# EAGLE design HB-UNI-SenAct-4-4-RC_V2.0 (EAGLE 9.3.1)
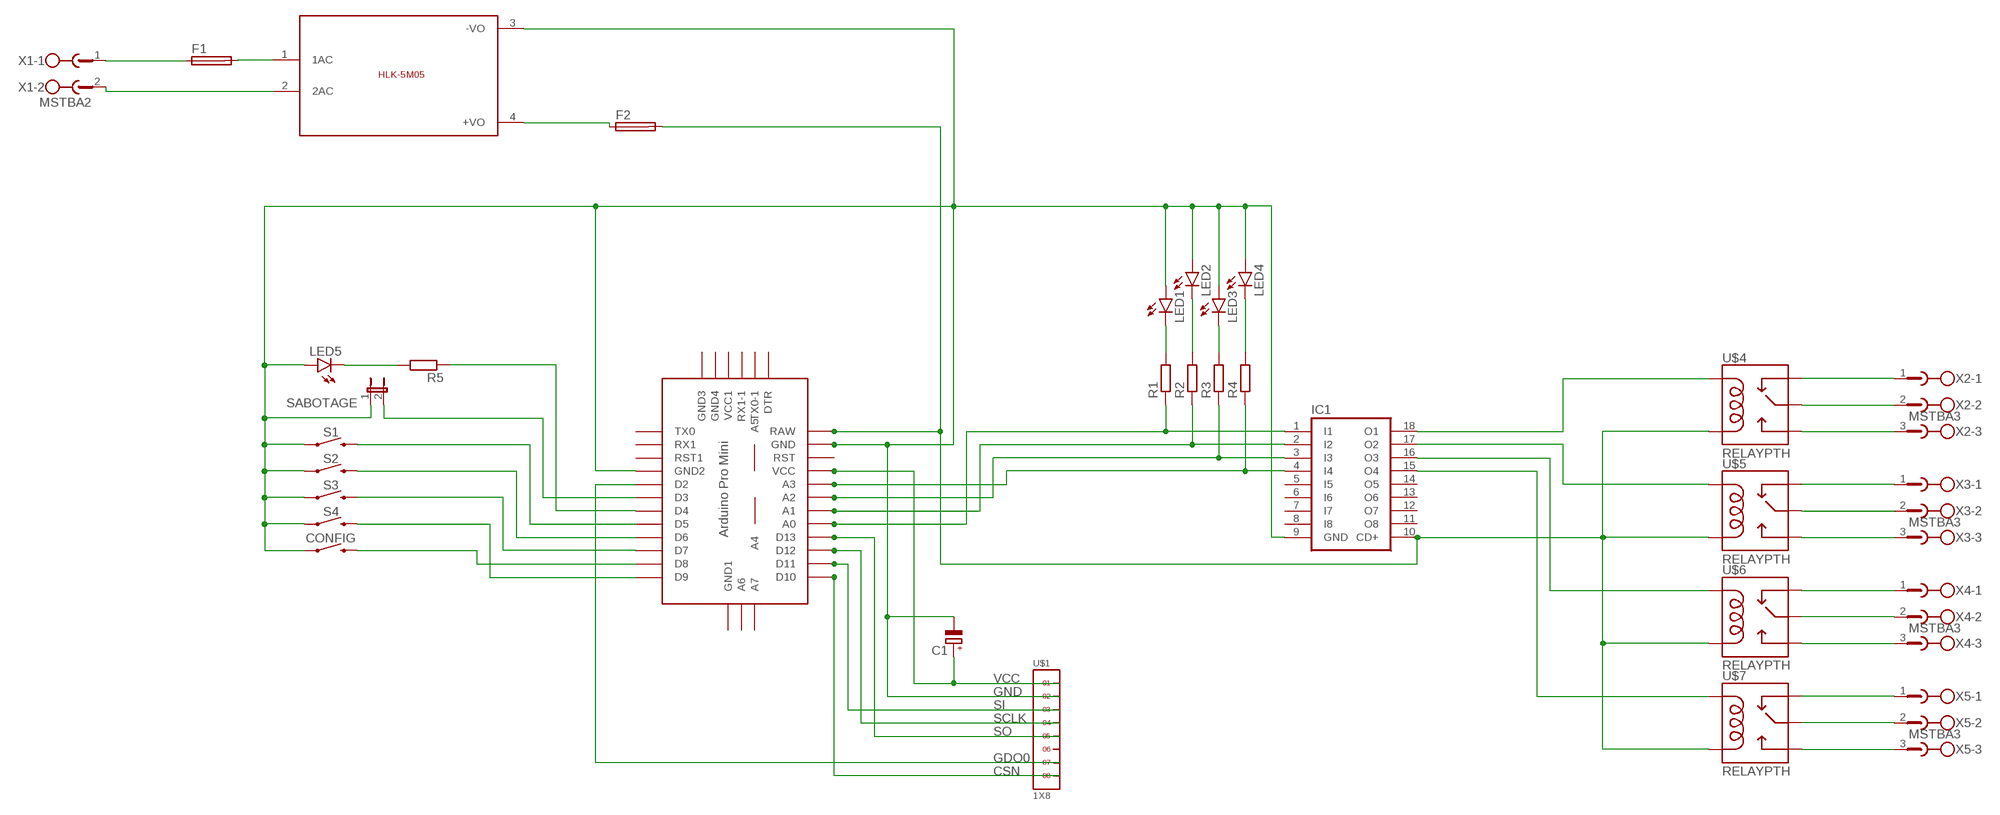
[diagram p0: schematic, sheet 1]

## Parts
C1  CPOL-EUE2.5-5  [E2,5-5]
CONFIG  MOMENTARY-SWITCH-SPST-PTH-6.0MM-KIT  [TACTILE_SWITCH_PTH_6.0MM_KIT]
F1  SH22,5A  [SH22,5A]
F2  SH22,5A  [SH22,5A]
IC1  ULN2803A  [DIL18]
LED1  LED3MM  [LED3MM]
LED2  LED3MM  [LED3MM]
LED3  LED3MM  [LED3MM]
LED4  LED3MM  [LED3MM]
LED5  LED3MM  [LED3MM]
R1  R-EU_0309/10  [0309/10]
R2  R-EU_0309/10  [0309/10]
R3  R-EU_0309/10  [0309/10]
R4  R-EU_0309/10  [0309/10]
R5  R-EU_0309/10  [0309/10]
S1  MOMENTARY-SWITCH-SPST-PTH-6.0MM-KIT  [TACTILE_SWITCH_PTH_6.0MM_KIT]
S2  MOMENTARY-SWITCH-SPST-PTH-6.0MM-KIT  [TACTILE_SWITCH_PTH_6.0MM_KIT]
S3  MOMENTARY-SWITCH-SPST-PTH-6.0MM-KIT  [TACTILE_SWITCH_PTH_6.0MM_KIT]
S4  MOMENTARY-SWITCH-SPST-PTH-6.0MM-KIT  [TACTILE_SWITCH_PTH_6.0MM_KIT]
SABOTAGE  JP1E  [JP1]
U$1  1X8  [1X8]
U$2  ABK-PRO-MINI  [ABK-PRO-MINI]
U$3  5VDC/5W  HLK-5M05  [HLK-5M05]
U$4  RELAYPTH  [SRD-05VDC-SL-C]
U$5  RELAYPTH  [SRD-05VDC-SL-C]
U$6  RELAYPTH  [SRD-05VDC-SL-C]
U$7  RELAYPTH  [SRD-05VDC-SL-C]
X1  MSTBA2  [MSTBA2]
X2  MSTBA3  [MSTBA3]
X3  MSTBA3  [MSTBA3]
X4  MSTBA3  [MSTBA3]
X5  MSTBA3  [MSTBA3]

## Nets
CSN: U$1.8 U$2.D10
GDO0: U$1.7 U$2.D2
GND: C1.- CONFIG.1 IC1.9(GND) LED1.A LED2.A LED3.A LED4.A LED5.A S1.1 S2.1 S3.1 S4.1 SABOTAGE.1 U$1.2 U$2.GND U$2.GND1(GND2) U$3.3(-VO)
N$1: IC1.1(I1) R1.1 U$2.A0
N$2: IC1.2(I2) R2.1 U$2.A1
N$3: IC1.3(I3) R3.1 U$2.A2
N$4: IC1.4(I4) R4.1 U$2.A3
N$5: LED1.K(C) R1.2
N$6: LED2.K(C) R2.2
N$7: LED3.K(C) R3.2
N$8: LED4.K(C) R4.2
N$9: F1.1 X1.1
N$10: F2.1 U$3.4(+VO)
N$11: U$3.2(2AC) X1.2
N$12: S1.3 U$2.D5
N$13: S2.3 U$2.D6
N$14: S3.3 U$2.D7
N$15: S4.3 U$2.D9
N$16: CONFIG.3 U$2.D8
N$17: R5.1 U$2.D4
N$18: LED5.K(C) R5.2
N$19: F1.2 U$3.1(1AC)
N$20: SABOTAGE.2 U$2.D3
N$21: U$6.SWCLOSED(SWCLOSE) X4.1
N$22: U$7.SWCOMMON X5.2
N$23: U$6.SWOPEN X4.3
N$24: F2.2 IC1.10(CD+) U$2.RAW U$4.COIL0 U$5.COIL0 U$6.COIL0 U$7.COIL0
N$25: U$7.SWCLOSED(SWCLOSE) X5.1
N$26: U$6.SWCOMMON X4.2
N$27: U$7.SWOPEN X5.3
N$28: U$5.SWOPEN X3.3
N$29: U$5.SWCOMMON X3.2
N$30: U$5.SWCLOSED(SWCLOSE) X3.1
N$31: U$4.SWOPEN X2.3
N$32: U$4.SWCOMMON X2.2
N$33: U$4.SWCLOSED(SWCLOSE) X2.1
N$34: IC1.18(O1) U$4.COIL1
N$35: IC1.17(O2) U$5.COIL1
N$36: IC1.16(O3) U$6.COIL1
N$37: IC1.15(O4) U$7.COIL1
SCLK: U$1.4 U$2.D12
SI: U$1.3 U$2.D11
SO: U$1.5 U$2.D13
VCC: C1.+ U$1.1 U$2.VCC
Unconnected: IC1.5(I5) IC1.6(I6) IC1.7(I7) IC1.8(I8) IC1.11(O8) IC1.12(O7) IC1.13(O6) IC1.14(O5) U$1.6 U$2.A4 U$2.A5 U$2.A6 U$2.A7 U$2.DTR U$2.GND2(GND3) U$2.GND3(GND4) U$2.GND4(GND1) U$2.RST U$2.RST1 U$2.RX1 U$2.RX1-1 U$2.TX0 U$2.TX0-1 U$2.VCC1

## Library data of the parts
C1 = resistor:CPOL-EU: POLARIZED CAPACITOR, European symbol
CONFIG S1-S4 = SparkFun-Switches:MOMENTARY-SWITCH-SPST: Momentary Switch (Pushbutton) - SPST Normally-open (NO) SPST momentary switches (buttons, pushbuttons). Variants PTH-12MM - 12mm square, through-hole Momentary Pushbutton Switch - 12mm Square <https://www.sparkfun.com/products/9190> (COM-09190) PTH-6.0MM, PTH-6.0MM-KIT - 6.0mm square, through-hole Mini Pushbutton Switch <https://www.sparkfun.com/products/97> (COM-00097) KIT package intended for soldering kit's - only one side of pads' copper is exposed. PTH-RIGHT-ANGLE-KIT - Right-angle, through-hole Right Angle Tactile Button <https://www.sparkfun.com/products/10791> - Used on SparkFun BigTime Watch Kit <https://www.sparkfun.com/products/11734> SMD-12MM - 12mm square, surface-mount Tactile Button - SMD (12mm) <https://www.sparkfun.com/products/12993> (COM-12993) Used on SparkFun PicoBoard <https://www.sparkfun.com/products/11888> SMD-4.5MM - 4.5mm Square Trackball Switch Used on SparkFun Blackberry Trackballer Breakout <https://www.sparkfun.com/products/13169> SMD-4.6MMX2.8MM - 4.60mm x 2.80mm, surface mount Used on SparkFun SAMD21 Mini Breakout <https://www.sparkfun.com/products/13664> SMD-5.2MM, SMD-5.2-REDUNDANT - 5.2mm square, surface-mount Mini Pushbutton Switch - SMD <https://www.sparkfun.com/products/8720> (COM-08720) Used on Arduino Pro Mini <https://www.sparkfun.com/products/11114> REDUNDANT package connects both switch circuits together SMD-6.0X3.5MM - 6.0 x 3.5mm, surface mount Momentary Reset Switch SMD <https://www.sparkfun.com/products/8229> (COM-08229) SMD-6.2MM-TALL - 6.2mm square, surface mount Tactile Button - SMD (6mm) <https://www.sparkfun.com/products/12992> Used on SparkFun Digital Sandbox <https://www.sparkfun.com/products/12651> SMD-RIGHT-ANGLE - Right-angle, surface mount Used on SparkFun Block for Intel® Edison - Arduino <https://www.sparkfun.com/products/13036>; PROD_ID: SWCH-08441; SF_SKU: COM-00097
F1 F2 = fuse:SH22,5A: FUSE HOLDER grid 22,5mm, isolated cap OGN0031 8201, Schurter (Buerklin); MPN: 0031.7701.11; OC_FARNELL: unknown; OC_NEWARK: 04F1224
IC1 = uln-udn:ULN2803A: DRIVER ARRAY
LED1-LED5 = led:LED: LED OSRAM: - CHIPLED LG R971, LG N971, LY N971, LG Q971, LY Q971, LO R971, LY R971 LH N974, LH R974 LS Q976, LO Q976, LY Q976 LO Q996 - Hyper CHIPLED LW Q18S LB Q993, LB Q99A, LB R99A - SideLED LS A670, LO A670, LY A670, LG A670, LP A670 LB A673, LV A673, LT A673, LW A673 LH A674 LY A675 LS A676, LA A676, LO A676, LY A676, LW A676 LS A679, LY A679, LG A679 - Hyper Micro SIDELED® LS Y876, LA Y876, LO Y876, LY Y876 LT Y87S - SmartLED LW L88C, LW L88S LB L89C, LB L89S, LG L890 LS L89K, LO L89K, LY L89K LS L896, LA L896, LO L896, LY L896 - TOPLED LS T670, LO T670, LY T670, LG T670, LP T670 LSG T670, LSP T670, LSY T670, LOP T670, LYG T670 LG T671, LOG T671, LSG T671 LB T673, LV T673, LT T673, LW T673 LH T674 LS T676, LA T676, LO T676, LY T676, LB T676, LH T676, LSB T676, LW T676 LB T67C, LV T67C, LT T67C, LS T67K, LO T67K, LY T67K, LW E67C LS E67B, LA E67B, LO E67B, LY E67B, LB E67C, LV E67C, LT E67C LW T67C LS T679, LY T679, LG T679 LS T770, LO T770, LY T770, LG T770, LP T770 LB T773, LV T773, LT T773, LW T773 LH T774 LS E675, LA E675, LY E675, LS T675 LS T776, LA T776, LO T776, LY T776, LB T776 LHGB T686 LT T68C, LB T68C - Hyper Mini TOPLED® LB M676 - Mini TOPLED Santana® LG M470 LS M47K, LO M47K, LY M47K Source: http://www.osram.convergy.de LUXEON: - LUMILED® LXK2-PW12-R00, LXK2-PW12-S00, LXK2-PW14-U00, LXK2-PW14-V00 LXK2-PM12-R00, LXK2-PM12-S00, LXK2-PM14-U00 LXK2-PE12-Q00, LXK2-PE12-R00, LXK2-PE12-S00, LXK2-PE14-T00, LXK2-PE14-U00 LXK2-PB12-K00, LXK2-PB12-L00, LXK2-PB12-M00, LXK2-PB14-N00, LXK2-PB14-P00, LXK2-PB14-Q00 LXK2-PR12-L00, LXK2-PR12-M00, LXK2-PR14-Q00, LXK2-PR14-R00 LXK2-PD12-Q00, LXK2-PD12-R00, LXK2-PD12-S00 LXK2-PH12-R00, LXK2-PH12-S00 LXK2-PL12-P00, LXK2-PL12-Q00, LXK2-PL12-R00 Source: www.luxeon.com KINGBRIGHT: KA-3528ASYC Source: www.kingbright.com
R1-R5 = resistor:R-EU_: RESISTOR, European symbol
SABOTAGE = jumper:JP1E: JUMPER
U$1 = headers(2mm):1X8
U$2 = Arduino-clone:ABK-PRO-MINI: ABK Pro-Mini Arduino Clone
U$3 = HLK-5M05:HLK-5M05: HLK-5M05 is an 5Volt/5W smps developed by HI-LINK; SIZE: 23x38(mm)
U$4-U$7 = SRD-05VDC-SL-C:RELAY: SPDT relay (COM-00101)
X1 = con-phoenix-508:MSTBA2: PHOENIX; MF: FARNELL; MPN: 1757242; OC_FARNELL: 3705171; OC_NEWARK: 71C4161
X2-X5 = con-phoenix-508:MSTBA3: PHOENIX; MF: FARNELL; MPN: 1757255; OC_FARNELL: 3705183; OC_NEWARK: 71C4162

## Board
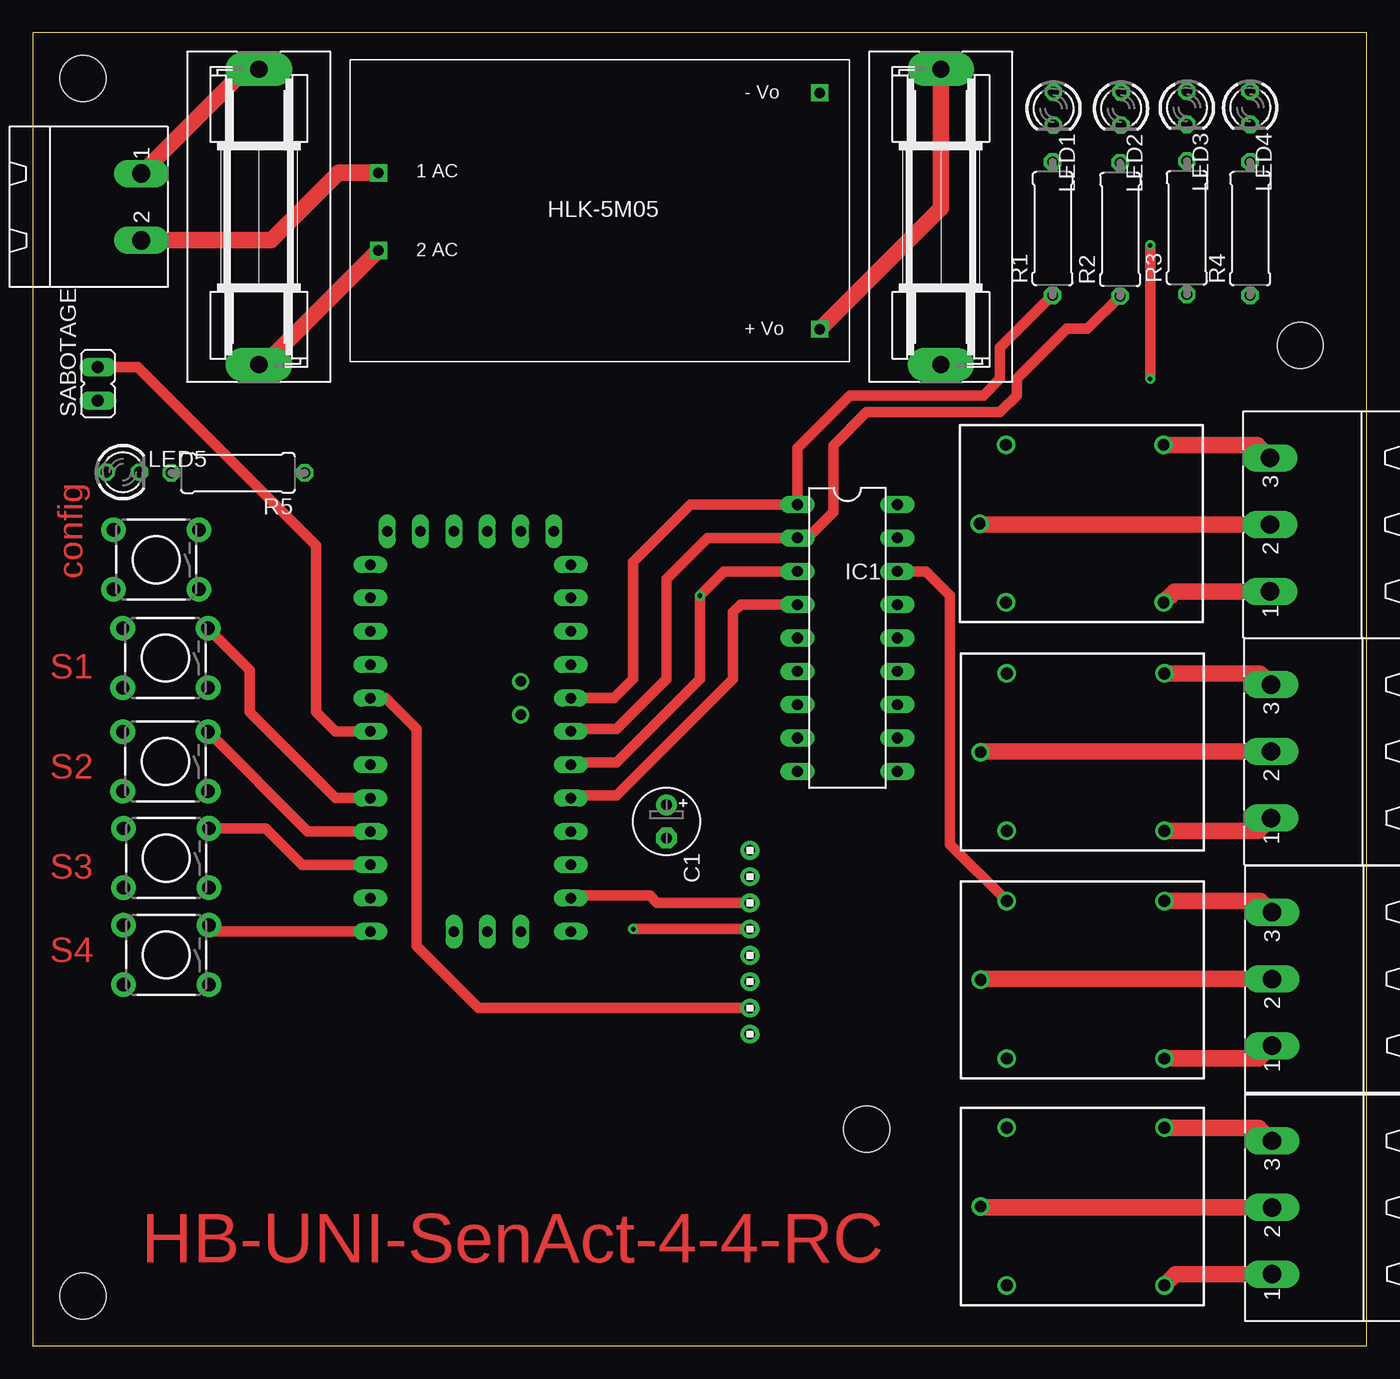
[diagram p1: board, top side]
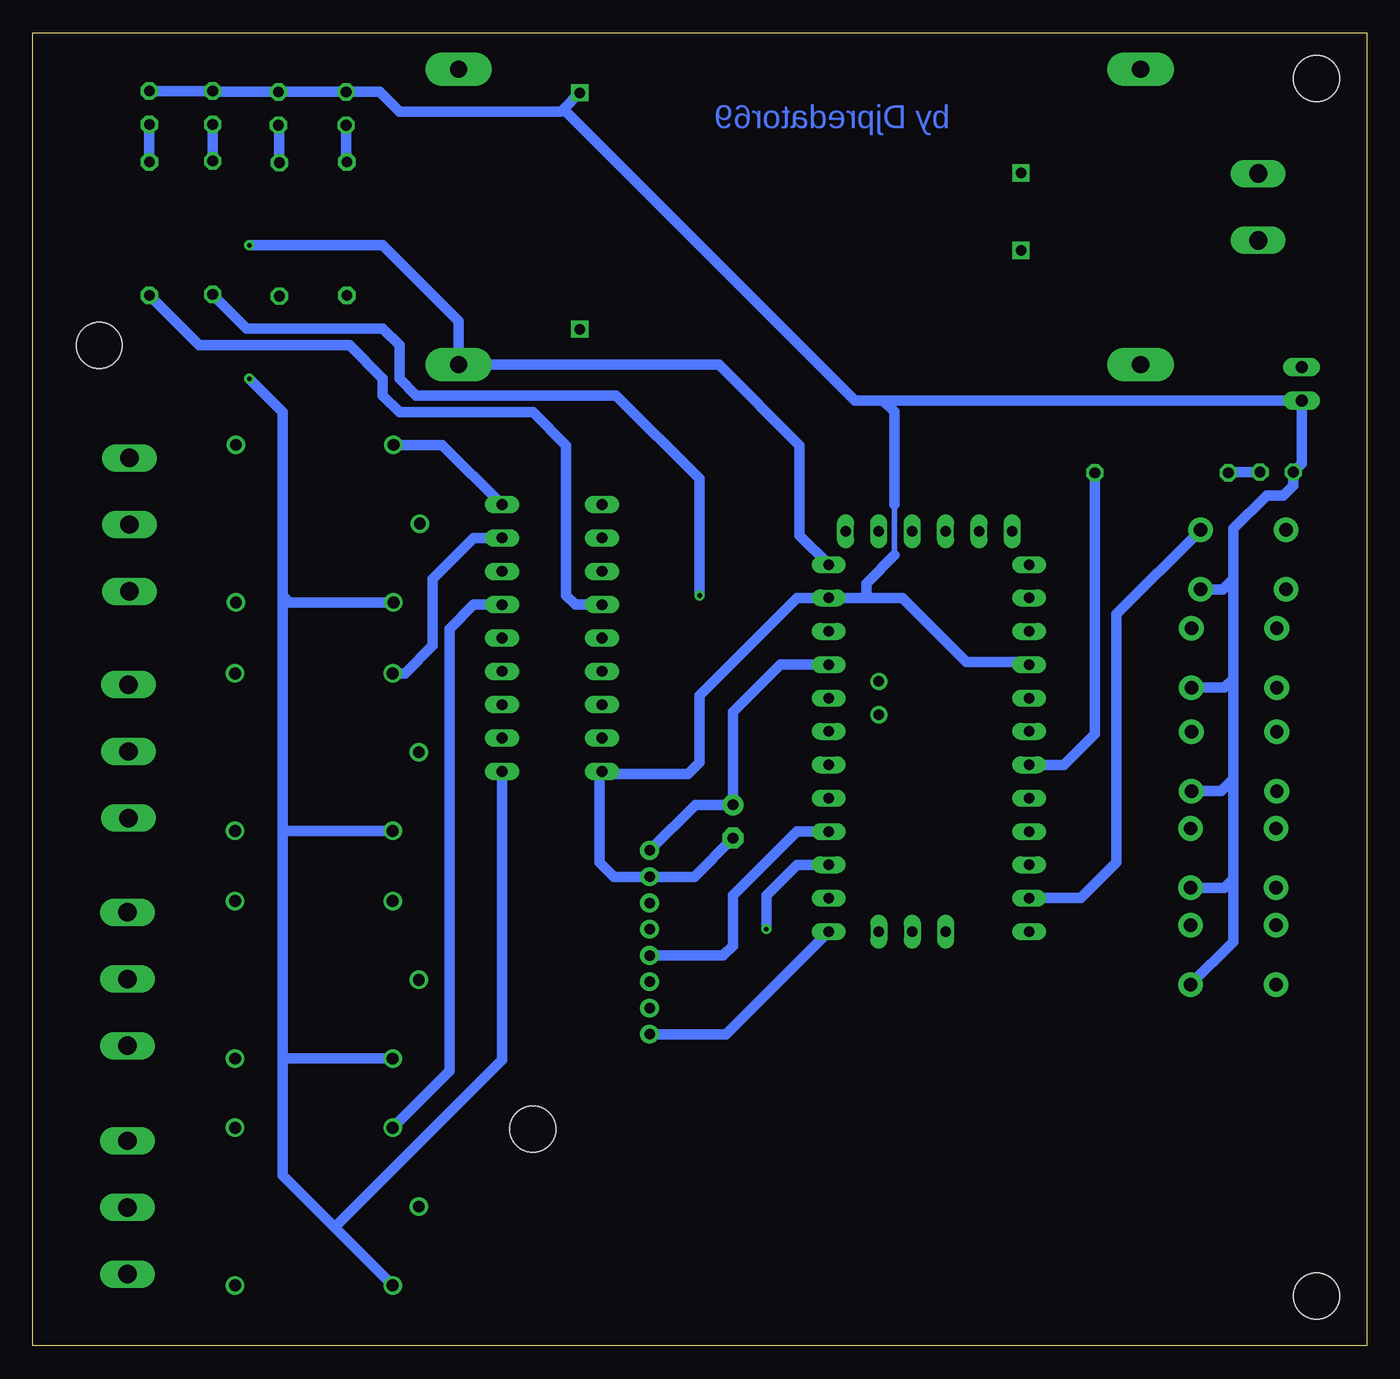
[diagram p2: board, bottom side, seen from below]

Size 101.58 x 100 mm. Coordinates in mm from the lower left corner, seen from the top.
Outline: 0,0 101.58,0 101.58,100 0,100 0,0
Copper layers (1*16): Top 0.035mm / dielectric 1.5mm / Bottom 0.035mm
Design rules "default": minimum track width 6mil, minimum drill 0.35mm, track to track 6mil, track to pad 6mil, pad to pad 6mil, via to via 6mil, smd to smd 6mil, copper to edge 40mil, drill to drill 6mil, minimum pad ring 10mil, minimum via ring 8mil, stop-mask expansion 4mil, vias tented up to drill 0mil, thermal gap 10mil
Holes 3.5 mm at 3.81,96.52 96.52,76.2 63.5,16.51 3.81,3.81

### Footprints (pad centres in the part's own frame; a part is rotated, then mirrored left to right if it is on the bottom)
E2,5-5 = drill 0.813 pad 1.6: + -1.27,0 | drill 0.813 pad 1.6 octagon: - 1.27,0
TACTILE_SWITCH_PTH_6.0MM_KIT = drill 1.016 pad 1.88: 1 -3.251,2.261; 2 3.251,2.261; 3 -3.251,-2.261; 4 3.251,-2.261
SH22,5A = drill 1.321 pad 2.54 long: 1 -11.252,0; 2 11.252,0
DIL18 = drill 0.813 long: 1 -10.16,-3.81; 2 -7.62,-3.81; 3 -5.08,-3.81; 4 -2.54,-3.81; 5 0,-3.81; 6 2.54,-3.81; 7 5.08,-3.81; 8 7.62,-3.81; 9 10.16,-3.81; 10 10.16,3.81; 11 7.62,3.81; 12 5.08,3.81; 13 2.54,3.81; 14 0,3.81; 15 -2.54,3.81; 16 -5.08,3.81; 17 -7.62,3.81; 18 -10.16,3.81
LED3MM = drill 0.813 octagon: A -1.27,0; K 1.27,0
0309/10 = drill 0.813 octagon: 1 -5.08,0; 2 5.08,0
JP1 = drill 0.914 long: 1 0,-1.27; 2 0,1.27
1X8 = drill 0.8 pad 1.422: 1 -7,0; 2 -5,0; 3 -3,0; 4 -1,0; 5 1,0; 6 3,0; 7 5,0; 8 7,0
ABK-PRO-MINI = drill 0.8 long: A0 10.16,-3.81; A1 10.16,-6.35; A2 10.16,-8.89; A3 10.16,-11.43; A6 3.81,-21.59; A7 6.35,-21.59; D2 -5.08,-3.81; D3 -5.08,-6.35; D4 -5.08,-8.89; D5 -5.08,-11.43; D6 -5.08,-13.97; D7 -5.08,-16.51; D8 -5.08,-19.05; D9 -5.08,-21.59; D10 10.16,-21.59; D11 10.16,-19.05; D12 10.16,-16.51; D13 10.16,-13.97; DTR 8.89,8.89; GND 10.16,3.81; GND1 -5.08,-1.27; GND2 -3.81,8.89; GND3 -1.27,8.89; GND4 1.27,-21.59; RAW 10.16,6.35; RST 10.16,1.27; RST1 -5.08,1.27; RX1 -5.08,3.81; RX1-1 3.81,8.89; TX0 -5.08,6.35; TX0-1 6.35,8.89; VCC 10.16,-1.27; VCC1 1.27,8.89 | drill 0.8: A4 6.35,-5.08; A5 6.35,-2.54
HLK-5M05 = drill 0.8 square: 1 -16.85,-2.93; 2 -16.85,2.97; 3 16.75,9.07; 4 16.75,-8.93
SRD-05VDC-SL-C = drill 0.9: COIL0 -5.39,-6.12; COIL1 -5.39,5.88; SWCLOSED 6.61,-6.12; SWCOMMON -7.39,-0.12; SWOPEN 6.61,5.88
MSTBA2 = drill 1.397 long: 1 -2.54,5.08; 2 2.54,5.08
MSTBA3 = drill 1.397 long: 1 -5.08,5.08; 2 0,5.08; 3 5.08,5.08

### Placement (x,y rotation side)
C1  48.26,39.94 270 top
CONFIG  9.4,59.88 180 top
F1  17.21,85.98 270 top
F2  69.15,85.98 270 top
IC1  62.04,53.91 270 top
LED1  77.72,94.23 270 top
LED2  82.87,94.23 270 top
LED3  87.88,94.3 270 top
LED4  92.71,94.3 270 top
LED5  6.86,66.55 0 top
R1  77.66,85.09 90 top
R2  82.8,85.03 90 top
R3  87.88,85.15 90 top
R4  92.71,85.09 90 top
R5  15.62,66.48 180 top
S1  10.1,52.39 180 top
S2  10.1,44.51 180 top
S3  10.16,37.15 180 top
S4  10.16,29.78 180 top
SABOTAGE  4.95,73.28 0 top
U$1  54.61,30.73 270 top
U$2  30.8,53.15 0 top
U$3  43.18,86.36 0 top
U$4  79.5,62.74 0 top
U$5  79.57,45.34 0 top
U$6  79.57,28 0 top
U$7  79.57,10.73 0 top
X1  3.17,86.74 270 top
X2  99.31,62.55 90 top
X3  99.38,45.28 90 top
X4  99.44,27.94 90 top
X5  99.44,10.54 90 top

### Tracks (layer width: path | path; a pad name or v marks a point on that pad's centre or on a via)
CSN
  Bottom 0.813: U$2.D10 48.78,23.73 U$1.8
GDO0
  Top 0.813: U$1.7 33.96,25.73 29.21,30.48 29.21,46.99 26.86,49.34 U$2.D2
GND
  Bottom 0.406: 35.95,60.21 35.95,64.05 35.98,64.08
  Bottom 0.813: U$3.3 61.17,94.19 | 61.17,94.19 61.38,93.98 73.66,93.98 75.18,95.5 LED1.A LED2.A 87.82,95.5 LED3.A LED4.A | 61.17,94.19 38.99,72.01 36.83,72.01 | 36.83,72.01 SABOTAGE.1 4.95,67.18 LED5.A 5.59,65.53 6.35,64.77 7.62,64.77 10.16,62.23 10.16,58.42 | S4.1 10.16,30.77 10.16,35.56 | 10.16,58.42 10.16,50.8 | 10.16,50.8 10.16,43.18 | 10.16,43.18 10.16,35.56 | S3.1 10.83,34.89 10.16,35.56 | S2.1 11.09,42.25 10.16,43.18 | S1.1 10.83,50.13 10.16,50.8 | CONFIG.1 10.96,57.62 10.16,58.42 | U$2.GND1 25.91,52.07 30.48,52.07 35.37,56.96 38.1,56.96 | 38.1,56.96 U$2.GND 43.37,56.96 50.8,49.53 50.8,44.45 51.69,43.56 58.42,43.56 | 38.1,56.96 38.1,58.07 35.95,60.21 | 35.98,64.08 35.98,71.16 36.83,72.01 | C1.- 51.2,35.73 U$1.2 57.32,35.73 58.42,36.83 58.42,43.56 | 58.42,43.56 IC1.9
N$1
  Top 0.813: U$2.A0 44.26,49.34 45.72,50.8 45.72,59.69 50.1,64.07 IC1.1 58.23,68.39 62.23,72.39 72.39,72.39 73.66,73.66 73.66,76.01 R1.1
N$2
  Top 0.813: U$2.A1 41.15,46.99 44.45,46.99 48.26,50.8 48.26,58.42 51.37,61.53 IC1.2 58.99,61.53 60.96,63.5 60.96,68.58 63.5,71.12 73.66,71.12 74.93,72.39 74.93,73.66 78.74,77.47 80.33,77.47 R2.1
N$3  (via drill 0.35)
  Top 0.813: U$2.A2 41.15,44.45 44.45,44.45 50.8,50.8 v50.8,57.15 52.64,58.99 IC1.3
  Bottom 0.813: R3.1 85.28,77.47 74.93,77.47 73.66,76.2 73.66,73.66 72.39,72.39 57.15,72.39 50.8,66.04 v50.8,57.15
N$4
  Top 0.813: U$2.A3 41.15,41.91 44.45,41.91 53.34,50.8 53.34,55.88 53.91,56.45 IC1.4
  Bottom 0.813: R4.1 88.9,76.2 77.47,76.2 74.93,73.66 74.93,72.39 73.66,71.12 63.5,71.12 60.96,68.58 60.96,57.15 60.26,56.45 IC1.4
N$5
  Bottom 0.813: LED1.K 77.72,90.23 R1.2
N$6
  Bottom 0.813: LED2.K 82.8,92.9 R2.2
N$7
  Bottom 0.813: LED3.K R3.2
N$8
  Bottom 0.813: LED4.K R4.2
N$9
  Top 1.27: X1.1 16.76,97.79 17.77,97.79 | 17.78,97.79 17.77,97.79 | 17.77,97.79 F1.1
N$10
  Top 1.27: F2.1 69.15,86.65 U$3.4
N$11
  Top 1.27: X1.2 18.16,84.2 23.29,89.33 U$3.2
N$12
  Top 0.813: U$2.D5 23.05,41.72 16.51,48.26 16.51,51.49 S1.3
N$13
  Top 0.813: S2.3 20.94,39.18 U$2.D6
N$14
  Top 0.813: U$2.D7 20.51,36.64 17.74,39.41 S3.3
N$15
  Top 0.813: S4.3 13.89,31.56 U$2.D9
N$16
  Bottom 0.813: CONFIG.3 19.05,55.74 19.05,36.83 21.78,34.1 U$2.D8
N$17
  Bottom 0.813: R5.1 20.7,46.61 23.05,44.26 U$2.D4
N$18
  Bottom 0.813: LED5.K 10.48,66.55 R5.2
N$19
  Top 1.27: U$3.1 17.63,74.73 F1.2
N$20
  Top 0.813: SABOTAGE.2 8,74.55 21.59,60.96 21.59,48.26 23.05,46.8 U$2.D3
N$21
  Top 1.27: U$6.SWCLOSED 93.39,21.88 X4.1
N$22
  Top 1.27: X5.2 72.25,10.54 U$7.SWCOMMON
N$23
  Top 1.27: U$6.SWOPEN 93.5,33.88 X4.3
N$24  (via drill 0.35)
  Top 0.813: v85.09,83.82 v85.09,73.66
  Bottom 0.813: U$2.RAW 43.18,61.72 43.18,68.58 49.33,74.73 F2.2 69.15,78.04 74.93,83.82 v85.09,83.82 | v85.09,73.66 82.55,71.12 82.55,57.15 | 82.55,57.15 82.55,39.37 | 82.55,39.37 82.55,21.59 | 82.55,21.59 82.55,12.99 78.6,9.03 | 78.6,9.03 U$7.COIL0 | U$6.COIL0 82.26,21.88 82.55,21.59 | U$5.COIL0 82.4,39.22 82.55,39.37 | U$4.COIL0 82.02,56.62 82.55,57.15 | IC1.10 65.85,21.78 78.6,9.03
N$25
  Top 1.27: U$7.SWCLOSED 87.03,5.46 X5.1
N$26
  Top 1.27: X4.2 72.23,27.94 U$6.SWCOMMON
N$27
  Top 1.27: U$7.SWOPEN 93.37,16.61 X5.3
N$28
  Top 1.27: U$5.SWOPEN 93.43,51.22 X3.3
N$29
  Top 1.27: X3.2 72.23,45.28 U$5.SWCOMMON
N$30
  Top 1.27: U$5.SWCLOSED 93.32,39.22 X3.1
N$31
  Top 1.27: U$4.SWOPEN 93.24,68.62 X2.3
N$32
  Top 1.27: X2.2 72.18,62.55 U$4.SWCOMMON
N$33
  Top 1.27: U$4.SWCLOSED 86.96,57.47 X2.1
N$34
  Bottom 0.813: IC1.18 70.4,68.62 U$4.COIL1
N$35
  Bottom 0.813: IC1.17 68.01,61.53 71.12,58.42 71.12,53.34 73.24,51.22 U$5.COIL1
N$36
  Top 0.813: U$6.COIL1 69.85,38.21 69.85,57.15 68.01,58.99 IC1.16
N$37
  Bottom 0.813: U$7.COIL1 69.85,20.94 69.85,54.61 68.01,56.45 IC1.15
SCLK  (via drill 0.35)
  Top 0.813: v45.72,31.75 54.59,31.75 U$1.4
  Bottom 0.813: U$2.D12 43.37,36.64 45.72,34.29 v45.72,31.75
SI
  Top 0.813: U$1.3 47.55,33.73 46.99,34.29 41.15,34.29 U$2.D11
SO
  Bottom 0.813: U$2.D13 43.37,39.18 48.26,34.29 48.26,30.48 49.01,29.73 U$1.5
VCC
  Bottom 0.813: U$1.1 51.13,41.21 C1.+ 48.26,48.26 44.64,51.88 U$2.VCC

### Text on the board
Top: config | S1 | S2 | S3 | S4 | HB-UNI-SenAct-4-4-RC
Bottom: by Djpredator69